# EAGLE design 4H-LedLight (EAGLE 7.5.0)
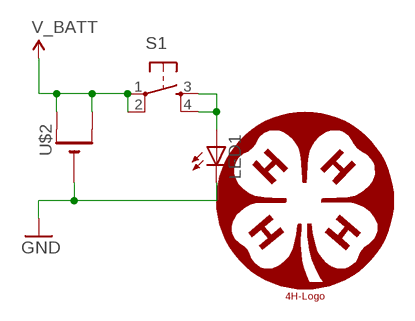
[diagram p0: schematic, sheet 1]

## Parts
LED1  LEDOVAL  [LED-OVAL]
S1  TAC_SWITCHPTH  [TACTILE-PTH]
U$1  4H-LOGO6  [4H_LOGO_6]
U$2  CR2032THM  [CR2032-THRU]

## Nets
GND: LED1.CATHODE(C) U$2.-
N$2: LED1.ANODE(A) S1.3 S1.4
V_BATT: S1.1 S1.2 U$2.+1(+) U$2.+2(+1)

## Library data of the parts
LED1 = barbary_enterprises:LED: LEDs Standard schematic elements and footprints for 5mm, 3mm, 1206, and 0603 sized LEDs. 5mm - Spark Fun Electronics SKU : COM-00529 (and others)
S1 = barbary_enterprises:TAC_SWITCH: Momentary Switch Button commonly used for reset or general input. Spark Fun Electronics SKU : COM-00097 SMT- SWCH-08247
U$1 = 4h:4H-LOGO: 18 USC 707 R=51, G=153, B=102 #339966
U$2 = battery:CR2032

## Board
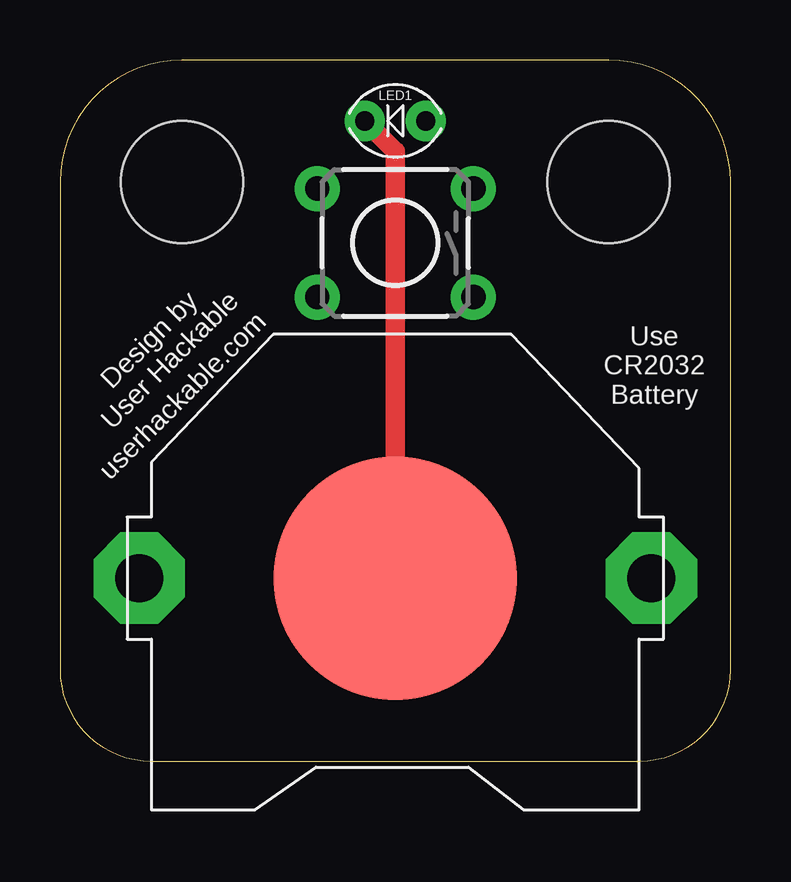
[diagram p1: board, top side]
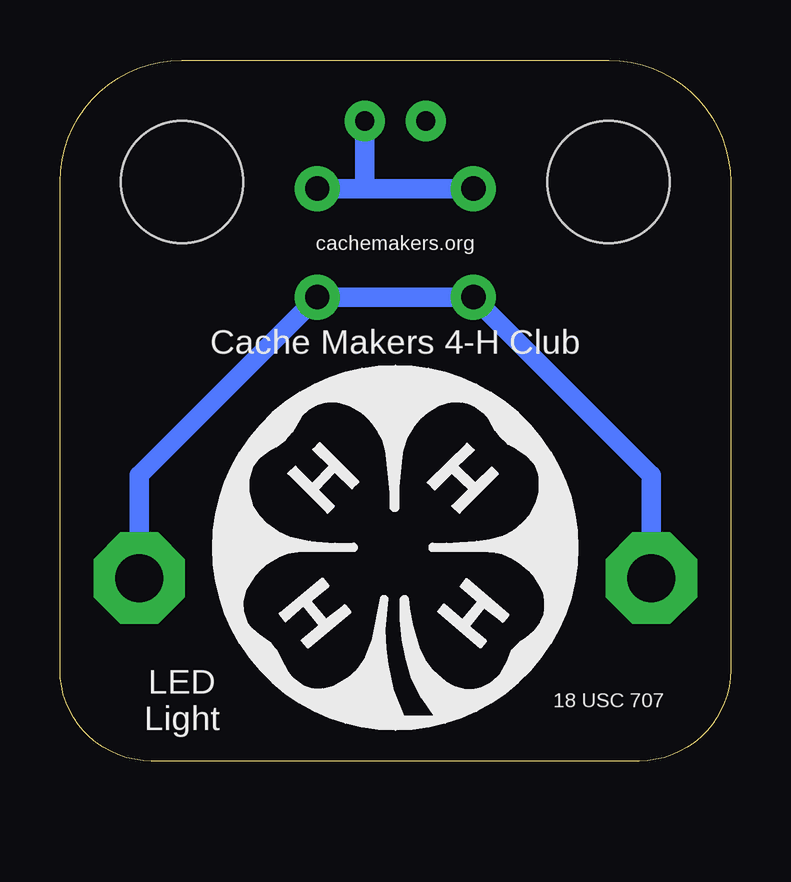
[diagram p2: board, bottom side, seen from below]

Size 27.94 x 29.21 mm. Coordinates in mm from the lower left corner, seen from the top.
Outline: 0,24.13 0,3.81 arc90 3.81,0 24.13,0 arc90 27.94,3.81 27.94,24.13 arc90 22.86,29.21 5.08,29.21 arc90 0,24.13
Copper layers (1*16): Top 0.035mm / dielectric 1.5mm / Bottom 0.035mm
Design rules "default": minimum track width 10mil, minimum drill 24mil, track to track 8mil, track to pad 8mil, pad to pad 8mil, via to via 8mil, smd to smd 8mil, copper to edge 40mil, drill to drill 8mil, minimum pad ring 10mil, minimum via ring 8mil, stop-mask expansion 4mil, vias tented up to drill 0mil, thermal gap 10mil
Holes 5.08 mm at 5.08,24.13 22.86,24.13

### Footprints (pad centres in the part's own frame; a part is rotated, then mirrored left to right if it is on the bottom)
LED-OVAL = drill 0.8 pad 1.676: ANODE 1.27,0; CATHODE -1.27,0
TACTILE-PTH = drill 1.016 pad 1.88: 1 -3.251,2.261; 2 3.251,2.261; 3 -3.251,-2.261; 4 3.251,-2.261
CR2032-THRU = drill 2 pad 3.81 octagon: +1 -10.668,0; +2 10.668,0 | smd 10.16 x 10.16: - 0,0

### Placement (x,y rotation side)
LED1  13.97,26.67 0 top
S1  13.97,21.59 180 top
U$1  13.97,8.89 0 bottom
U$2  13.97,7.62 180 top

### Tracks (layer width: path | path; a pad name or v marks a point on that pad's centre or on a via)
GND
  Top 0.813: U$2.- 13.97,25.4 LED1.CATHODE
N$2
  Bottom 0.813: S1.4 15.24,23.85 | 15.24,23.85 S1.3 | LED1.ANODE 15.24,23.85
V_BATT
  Bottom 0.813: U$2.+2 3.3,11.91 S1.2 S1.1 24.64,11.91 U$2.+1

### Text on the board
tPlace: Design by / User Hackable | Use / CR2032 / Battery | userhackable.com
bPlace: cachemakers.org | Cache Makers 4-H Club | 18 USC 707 | LED / Light